# Altium schematic sheet 0002_page 2.SchDoc
size 426 x 274 mm
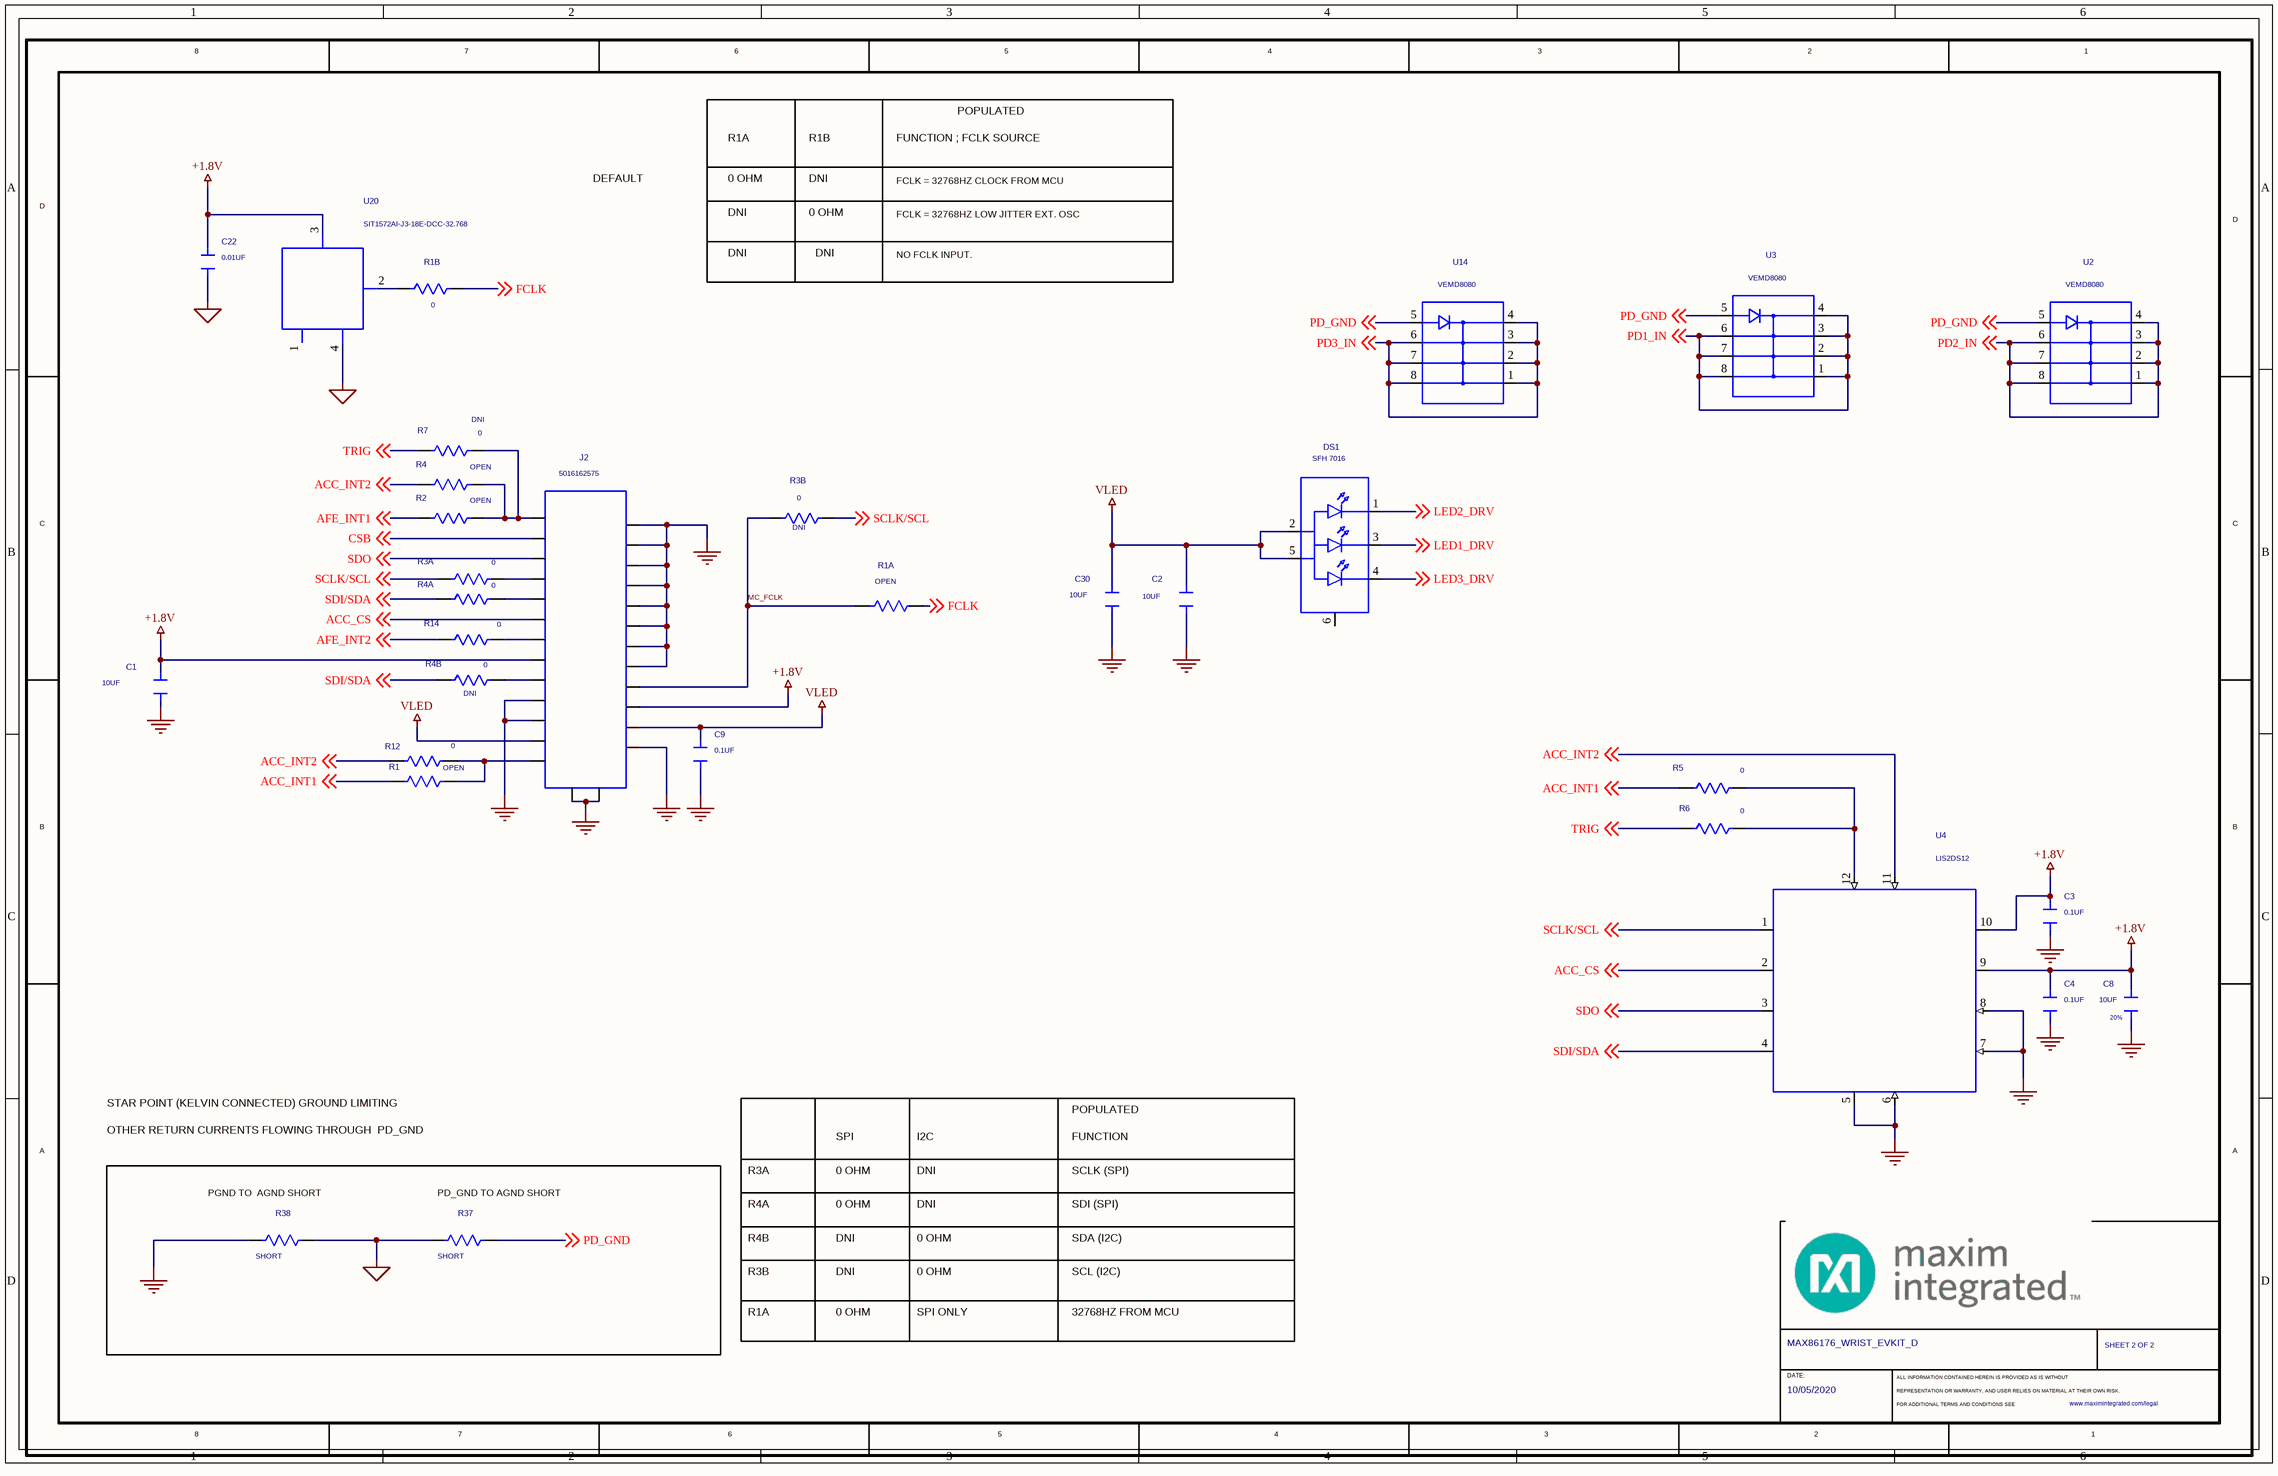
[diagram p0: 0002_page 2.SchDoc]

## Parts
*  PROJECT_TITLE: MAX86176_WRIST_EVKIT_D  CUSTOM_TXT_CDS21: SHEET 2 OF 2  DATE: 10/05/2020  (hidden comment: MAXIM_B_SIZE_CF)  (graphical)
C1  10UF  [0603]
C2  10UF  [0603]
C3  0.1UF  [0603]
C4  0.1UF  [0603]
C8  10UF  TOLERANCE: 20%  [0402]
C9  0.1UF  [CAPC0603X33M]
C22  0.01UF  [CAPC0603X33M]
C30  10UF  [0603]
DS1  SFH 7016  [LED_SFH7016]
J2  5016162575  [MOLEX_501616-2575]
R1  OPEN  [0402]
R1A  OPEN  [RESC0603X33M]
R1B  0  [RESC0603X33M]
R2  OPEN  [0402]
R3A  0  [0402]
R3B  0  VARIANT: DNI  [0402]
R4  OPEN  [0402]
R4A  0  [0402]
R4B  0  VARIANT: DNI  [0402]
R5  0  [RESC0603X33M]
R6  0  [RESC0603X33M]
R7  0  VARIANT: DNI  [RESC0603X33M]
R12  0  [RESC0603X33M]
R14  0  [RESC0603X33M]
R37  SHORT  [RESC0603X23L_SHORT]
R38  SHORT  [RESC0603X23L_SHORT]
U2  VEMD8080  [DIO_VEMD8080]
U3  VEMD8080  [DIO_VEMD8080]
U4  LIS2DS12  [STMC_LGA-12]
U14  VEMD8080  [DIO_VEMD8080]
U20  SIT1572AI-J3-18E-DCC-32.768  [OSC_SIT1572XX-JX-XXX]

## Nets
+1.8V: C1.2 C3.2 C4.2 C8.2 C22.2 J2.15 J2.20 U4.9(VDD) U4.10(VDDIO) U20.3(VDD)
AGND: C22.1 R37.1 R38.2 U20.4(GND)
PGND: C1.1 C2.1 C3.1 C4.1 C8.1 C9.1 C30.1 J2.2 J2.4 J2.6 J2.8 J2.10 J2.12 J2.14 J2.16 J2.19 J2.21 J2.24 J2.26 J2.27 R38.1 U4.5(NC) U4.6(GND_1) U4.7(RES) U4.8(GND_2)
VLED: C2.2 C9.2 C30.2 DS1.2(A_1) DS1.5(A_2) J2.22 J2.23
ACC_CS: J2.11 U4.2(CS) ; off-sheet ACC_CS
ACC_INT1: R1.1 R5.1 ; off-sheet ACC_INT1
ACC_INT2: R4.1 R12.1 U4.11(INT2) ; off-sheet ACC_INT2
AFE_INT1: R2.1 ; off-sheet AFE_INT1
AFE_INT2: R14.1 ; off-sheet AFE_INT2
CSB: J2.3 ; off-sheet CSB
FCLK: R1A.2 R1B.2 ; off-sheet FCLK
LED1_DRV: DS1.3(K_2) ; off-sheet LED1_DRV
LED2_DRV: DS1.1(K_1) ; off-sheet LED2_DRV
LED3_DRV: DS1.4(K_3) ; off-sheet LED3_DRV
MC_FCLK: J2.18 R1A.1 R3B.1
PD1_IN: U3.1(K_1) U3.2(K_2) U3.3(K_3) U3.4(K_4) U3.6(K_5) U3.7(K_6) U3.8(K_7) ; off-sheet PD1_IN
PD2_IN: U2.1(K_1) U2.2(K_2) U2.3(K_3) U2.4(K_4) U2.6(K_5) U2.7(K_6) U2.8(K_7) ; off-sheet PD2_IN
PD3_IN: U14.1(K_1) U14.2(K_2) U14.3(K_3) U14.4(K_4) U14.6(K_5) U14.7(K_6) U14.8(K_7) ; off-sheet PD3_IN
PD_GND: R37.2 U2.5(A) U3.5(A) U14.5(A) ; off-sheet PD_GND
SCLK/SCL: R3A.1 R3B.2 U4.1(SCL/SPC) ; off-sheet SCLK/SCL
SDI/SDA: R4A.1 R4B.1 U4.4(SDA/SDI/SDO) ; off-sheet SDI/SDA
SDO: J2.5 U4.3(SDO/SA0) ; off-sheet SDO
TRIG: R6.1 R7.1 ; off-sheet TRIG
NetJ2_1: J2.1 R2.2 R4.2 R7.2
NetJ2_7: J2.7 R3A.2
NetJ2_9: J2.9 R4A.2
NetJ2_13: J2.13 R14.2
NetJ2_17: J2.17 R4B.2
NetJ2_25: J2.25 R1.2 R12.2
NetR1B_1: R1B.1 U20.2(CLK_OUT)
NetR5_2: R5.2 R6.2 U4.12(INT1)

Not connected (* = marked no-connect by the designer): DS1 6(NC); U20 1(NC)

## Notes on the sheet
- R1A
- R1B
- FUNCTION ; FCLK SOURCE
- POPULATED
- DEFAULT
- 0 OHM
- DNI
- FCLK = 32768HZ CLOCK FROM MCU
- NO FCLK INPUT.
- FCLK = 32768HZ LOW JITTER EXT. OSC
- STAR POINT (KELVIN CONNECTED) GROUND LIMITING
- OTHER RETURN CURRENTS FLOWING THROUGH  PD_GND
- SPI
- I2C
- FUNCTION
- (near R38) PGND TO  AGND SHORT
- (near R37) PD_GND TO AGND SHORT
- R4A
- R3A
- SCLK (SPI)
- SDI (SPI)
- R3B
- R4B
- SCL (I2C)
- SDA (I2C)
- SPI ONLY
- 32768HZ FROM MCU
- (in symbol MAXIM_B_SIZE_CF) 8; 7; 6; 5; 4; 3; 1; D; C; B; A; DATE:; ALL INFORMATION CONTAINED HEREIN IS PROVIDED AS IS WITHOUT; REPRESENTATION OR WARRANTY, AND USER RELIES ON MATERIAL AT THEIR OWN RISK.; FOR ADDITIONAL TERMS AND CONDITIONS SEE

## Library data of the parts
* = MAXIM_B_SIZE_CF: OriginalSymbolOrigin: (175,5230); COMMENT_BODY: TRUE; Page Number: 2; CURRENT_DESIGN_SHEET: page 2; LEAGAL_WEBLINK: www.maximintegrated.com/legal; WEBLINK1: www.maximintegrated.com
C1 C2 C30 = EK_CAP_NP: CAP; SMT (0603); 10UF; 20%; 25V; X5R; CERAMIC CHIP; MFG_PART_NUMBER: GRM188R61E106MA73; MANUFACTURER: MURATA; OriginalSymbolOrigin: (-50,50); MAXINV: 20-0010U-P7; CAP: 1.00E-05; DRAWING: @MAX86176_WRIST_EVKIT_D.MAX86176_WRIST_EVKIT_D(SCH_1):PAGE4; PHYS_PAGE: 2; TEMP_RANGE: -55 DEGC TO +85 DEGC; VLOG_PARAM01: CAP:INTEGER; PACK_TYPE: 0603; PCB Footprint_CDS: 0603; CASE: SMT (0603); REFLOW: -; TOLERANCE: 20%; VER: 2; VOLTAGE_RATING: 25V; MATERIAL_TYPE: CERAMIC CHIP
C3 C4 = CAP_NP: CAP; SMT (0603); 0.1UF; 10%; 100V; X7R; CERAMIC; MFG_PART_NUMBER: GRM188R72A104KA35; CC0603KRX7R0BB104; MANUFACTURER: YAGEO;MURATA;TAIYO YUDEN;AVX;MURATA; OriginalSymbolOrigin: (-50,50); PACK_TYPE: 0603CAP; MAXINV: 20-000U1-01; CAP: 1.00E-07; DRAWING: @MAX86176_WRIST_EVKIT_D.MAX86176_WRIST_EVKIT_D(SCH_1):PAGE4; PHYS_PAGE: 2; TEMP_RANGE: -55 DEGC TO +125 DEGC; VLOG_PARAM01: CAP:INTEGER; PCB Footprint_CDS: 0603; REFLOW: -; TOLERANCE: 10%; VER: 2; VOLTAGE_RATING: 100V
C8 = CAP_NP#1: CAP; SMT (0402); 10UF; 20%; 10V; X5R; CERAMIC; MFG_PART_NUMBER: GRM155R61A106ME44;GRM155R61A106ME11;0402ZD106MAT2A;CL05A106MP5NUNC; MANUFACTURER: MURATA;MURATA;AVX;SAMSUNG; OriginalSymbolOrigin: (-50,50); PACK_TYPE: 0402CAP; MAXINV: 20-0010U-BA12; CAP: 1.00E-05; DRAWING: @MAX86176_WRIST_EVKIT_D.MAX86176_WRIST_EVKIT_D(SCH_1):PAGE4; PHYS_PAGE: 2; VER: 1; TEMP_RANGE: -55 DEGC TO +85 DEGC; VLOG_PARAM01: CAP:INTEGER; PCB Footprint_CDS: 0402; CASE: SMT (0402); REFLOW: -; VOLTAGE_RATING: 10V
C9 = CAP_NP: CAP; SMT (0201); 0.1UF; 10%; 10V; X5R; CERAMIC; MFG_PART_NUMBER: GRM033R61A104KE15; LMK063BJ104KP; MANUFACTURER: MURATA;TAIYO YUDEN; OriginalSymbolOrigin: (-50,50); PACK_TYPE: 0201CAPM; MAXINV: 20-000U1-H9; CAP: 1.00E-07; DRAWING: @MAX86176_WRIST_EVKIT_D.MAX86176_WRIST_EVKIT_D(SCH_1):PAGE4; PHYS_PAGE: 2; TEMP_RANGE: -55 DEGC TO +85 DEGC; VLOG_PARAM01: CAP:INTEGER; PCB Footprint_CDS: CAPC0603X33M; CASE: SMT (0201); REFLOW: -; TOLERANCE: N/A; VER: 2; VOLTAGE_RATING: 10V; MATERIAL_TYPE: CERAMIC
C22 = CAP_NP: CAP; SMT (0201); 0.01UF; 10%; 10V; X7R; CERAMIC; MFG_PART_NUMBER: C0603X7R1A103K030BA;GRM033R71A103KA01;GCM033R71A103KA03;CGA1A2X7R1A103K030BA;0201ZC103KAT2A; MANUFACTURER: TDK;MURATA;MURATA;TDK;AVX; OriginalSymbolOrigin: (-50,50); PACK_TYPE: 0201CAPM; MAXINV: 20-00U01-I6; CAP: 1.00E-08; DRAWING: @MAX86176_WRIST_EVKIT_D.MAX86176_WRIST_EVKIT_D(SCH_1):PAGE4; PHYS_PAGE: 2; TEMP_RANGE: -55 DEGC TO +125 DEGC; VLOG_PARAM01: CAP:INTEGER; MATERIAL_TYPE: CERAMIC CHIP; PCB Footprint_CDS: CAPC0603X33M; CASE: SMT (0201); REFLOW: -; TOLERANCE: 10%; VER: 2; VOLTAGE_RATING: 10V
DS1 = LED_6P: DIODE; LED; RED-GREEN-IR; SMT; VF=RED=2.1V; GREEN=2.5V; IR=1.3V; IF=RED=0.04A; GREEN=0.03A; IR=0.06A ;NOTE:PURCHASE DIRECT FROM THE MANUFACTURER; MANUFACTURER: OSRAM; OriginalSymbolOrigin: (-125,250); MAXINV: ED111000003532; DRAWING: @MAX86176_WRIST_EVKIT_D.MAX86176_WRIST_EVKIT_D(SCH_1):PAGE4; PHYS_PAGE: 2; VER: 7; TEMP_RANGE: -40 DEGC TO +85 DEGC; PACK_TYPE: LED_SFH7016; PCB Footprint_CDS: LED_SFH7016; MFG_PART_NUMBER: SFH 7016; SEC_TYPE: LED_SFH7016; TOLERANCE: N/A; VOLTAGE_RATING: RED=2.1V; GREEN=2.5V; IR=1.3V
J2 = 501616-2575: CONNECTOR; FEMALE; SMT; EASY-ON TYPE FPC CONNECTOR; RIGHT ANGLE; 25PINS ;NOTE:DISCONTINUED BY MANUFACTURER; MANUFACTURER: MOLEX; OriginalSymbolOrigin: (-150,550); PACK_TYPE: RA; MAXINV: 01-501616257525P-29; DRAWING: @MAX86176_WRIST_EVKIT_D.MAX86176_WRIST_EVKIT_D(SCH_1):PAGE4; PHYS_PAGE: 2; VER: 1; VOLTAGE_RATING: +50V; TEMP_RANGE: -40 DEGC TO +85 DEGC; PCB Footprint_CDS: MOLEX_501616-2575; MFG_PART_NUMBER: 5016162575; REFLOW: -; SEC_TYPE: RA; TOLERANCE: N/A
R1 R2 R4 = EVK_GENERIC_RESISTORS: PACKAGE OUTLINE 0402 RESISTOR - EVKIT; OriginalSymbolOrigin: (-75,50); DRAWING: @MAX86176_WRIST_EVKIT_D.MAX86176_WRIST_EVKIT_D(SCH_1):PAGE4; PHYS_PAGE: 2; PACK_TYPE: 0402RES; MAXINV: N/A; PCB Footprint_CDS: 0402; CASE: SMT (0402); MFG_PART_NUMBER: N/A; POWER_RATING: N/A; TOLERANCE: N/A; VER: 2; VOLTAGE_RATING: N/A; MANUFACTURER: N/A; TEMP_RANGE: N/A; MATERIAL_TYPE: N/A
R1A = EVK_GENERIC_RESISTORS#1: PACKAGE OUTLINE 0201 RESISTOR - EVKIT; OriginalSymbolOrigin: (-50,75); DRAWING: @MAX86176_WRIST_EVKIT_D.MAX86176_WRIST_EVKIT_D(SCH_1):PAGE4; PHYS_PAGE: 2; VER: 4; PACK_TYPE: 0201RES; MAXINV: N/A; PCB Footprint_CDS: RESC0603X33M; CASE: SMT (0201); MFG_PART_NUMBER: N/A; POWER_RATING: N/A; TOLERANCE: N/A; VOLTAGE_RATING: N/A; MANUFACTURER: N/A; TEMP_RANGE: N/A
R1B R14 = RES_SMD#1: RES; SMT (0201); 0; 1%; JUMPER; 0.0500W; MFG_PART_NUMBER: CRCW02010000ZS;ERJ-1GN0R00; MANUFACTURER: VISHAY DALE;PANASONIC; OriginalSymbolOrigin: (-75,50); PACK_TYPE: 0201RES; MAXINV: 80-0000R-95; DRAWING: @MAX86176_WRIST_EVKIT_D.MAX86176_WRIST_EVKIT_D(SCH_1):PAGE4; PHYS_PAGE: 2; POWER_RATING: 0.05W; RES: 0.00000001E00; TEMP_RANGE: -55 DEGC TO +155 DEGC; VLOG_PARAM01: RES:INTEGER; PCB Footprint_CDS: RESC0603X33M; CASE: SMT (0201); REFLOW: -; TOLERANCE: 1%; VER: 2
R3A R4A = RES_SMD#1: RES; SMT (0402); 0; JUMPER; JUMPER; 0.1000W; MFG_PART_NUMBER: ERJ-2GE0R00; MANUFACTURER: PANASONIC; OriginalSymbolOrigin: (-75,50); PACK_TYPE: 0402RES; MAXINV: 80-0000R-26A; DRAWING: @MAX86176_WRIST_EVKIT_D.MAX86176_WRIST_EVKIT_D(SCH_1):PAGE4; PHYS_PAGE: 2; POWER_RATING: 0.10W; RES: 0.00000001E00; TOLERANCE: 0%; TEMP_RANGE: -55 DEGC TO +155 DEGC; VLOG_PARAM01: RES:INTEGER; MATERIAL_TYPE: THICK FILM; PCB Footprint_CDS: 0402; CASE: SMT (0402); REFLOW: -; VER: 2
R3B R4B = RES_SMD#1: RES; SMT (0402); 0; JUMPER; JUMPER; 0.1000W; MFG_PART_NUMBER: ERJ-2GE0R00; MANUFACTURER: PANASONIC; OriginalSymbolOrigin: (-75,50); PACK_TYPE: 0402RES; MAXINV: 80-0000R-26A; DRAWING: @MAX86176_WRIST_EVKIT_D.MAX86176_WRIST_EVKIT_D(SCH_1):PAGE4; PHYS_PAGE: 2; POWER_RATING: 0.10W; RES: 0.00000001E00; TOLERANCE: 0%; TEMP_RANGE: -55 DEGC TO +155 DEGC; MATERIAL_TYPE: THICK FILM; VLOG_PARAM01: RES:INTEGER; PCB Footprint_CDS: 0402; CASE: SMT (0402); REFLOW: -; VER: 2
R5 R12 = RES_SMD#1: RES; SMT (0201); 0; 1%; JUMPER; 0.0500W; MFG_PART_NUMBER: CRCW02010000ZS;ERJ-1GN0R00; MANUFACTURER: VISHAY DALE;PANASONIC; OriginalSymbolOrigin: (-75,50); PACK_TYPE: 0201RES; MAXINV: 80-0000R-95; DRAWING: @MAX86176_WRIST_EVKIT_D.MAX86176_WRIST_EVKIT_D(SCH_1):PAGE4; PHYS_PAGE: 2; POWER_RATING: 0.05W; RES: 0.00000001E00; TEMP_RANGE: -55 DEGC TO +155 DEGC; MATERIAL_TYPE: THICK FILM; VLOG_PARAM01: RES:INTEGER; PCB Footprint_CDS: RESC0603X33M; CASE: SMT (0201); REFLOW: -; TOLERANCE: 1%; VER: 2
R6 R7 = RES_SMD#1: RES; SMT (0201); 0; 1%; JUMPER; 0.0500W; MFG_PART_NUMBER: CRCW02010000ZS;ERJ-1GN0R00; MANUFACTURER: VISHAY DALE;PANASONIC; OriginalSymbolOrigin: (-75,50); PACK_TYPE: 0201RES; MAXINV: 80-0000R-95; DRAWING: @MAX86176_WRIST_EVKIT_D.MAX86176_WRIST_EVKIT_D(SCH_1):PAGE4; PHYS_PAGE: 2; POWER_RATING: 0.05W; RES: 0.00000001E00; TEMP_RANGE: -55 DEGC TO +155 DEGC; VLOG_PARAM01: RES:INTEGER; MATERIAL_TYPE: THICK FILM; PCB Footprint_CDS: RESC0603X33M; CASE: SMT (0201); REFLOW: -; TOLERANCE: 1%; VER: 2
R37 R38 = EVK_GENERIC_RESISTORS: PACKAGE OUTLINE 0201 RESISTOR - EVKIT FORM FACTOR FOOTRINT; OriginalSymbolOrigin: (-75,50); PACK_TYPE: 0201RES_FF; DRAWING: @MAX86176_WRIST_EVKIT_D.MAX86176_WRIST_EVKIT_D(SCH_1):PAGE4; PHYS_PAGE: 2; MAXINV: N/A; PCB Footprint_CDS: RESC0603X23L_SHORT; CASE: SMT (0201); MFG_PART_NUMBER: N/A; POWER_RATING: N/A; TOLERANCE: N/A; VER: 2; VOLTAGE_RATING: N/A; MANUFACTURER: N/A; TEMP_RANGE: N/A; MATERIAL_TYPE: N/A
U2 U3 U14 = DIO_PIN_8P: DIODE; PIN; SMT; VRM=20V; IF=0.05A ;NOTE:PURCHASE DIRECT FROM THE MANUFACTURER; MANUFACTURER: VISHAY; OriginalSymbolOrigin: (-150,200); PACK_TYPE: SMD; MAXINV: ED1259; DRAWING: @MAX86176_WRIST_EVKIT_D.MAX86176_WRIST_EVKIT_D(SCH_1):PAGE4; PHYS_PAGE: 2; VER: 1; VOLTAGE_RATING: 20V; TEMP_RANGE: -40 DEGC TO +85 DEGC; PCB Footprint_CDS: DIO_VEMD8080; MFG_PART_NUMBER: VEMD8080; SEC_TYPE: SMD; TOLERANCE: N/A
U4 = LIS2DS12: IC; MEMS; DIGITAL OUTPUT MOTION SENSOR; ULTRA-LOW-POWER HIGH-PERFORMANCE 3-AXIS PICO ACCELEROMETER; MICROELECTROMECHANICAL SYSTEMS; LGA12; NOTE: MANUFACTURER; MANUFACTURER: ST MICROELECTRONICS; OriginalSymbolOrigin: (-375,375); MAXINV: EQ111000005315; DRAWING: @MAX86176_WRIST_EVKIT_D.MAX86176_WRIST_EVKIT_D(SCH_1):PAGE4; PHYS_PAGE: 2; VER: 1; VOLTAGE_RATING: +1.62V TO +1.98V; TEMP_RANGE: -40 DEGC TO +85 DEGC; PACK_TYPE: LGA12; PCB Footprint_CDS: STMC_LGA-12; CASE: LGA12; MFG_PART_NUMBER: LIS2DS12; TOLERANCE: N/A
U20 = SIT1572: OSCILLATOR; CSP 1.5 MM X 0.8 MM; 15PF; 32.768KHZ ; +/-10PPM; MANUFACTURER: SITIME CORPORATION; OriginalSymbolOrigin: (-175,200); PACK_TYPE: SMD; MAXINV: EX111000005339; DRAWING: @MAX86176_WRIST_EVKIT_D.MAX86176_WRIST_EVKIT_D(SCH_1):PAGE4; PHYS_PAGE: 2; VER: 1; VOLTAGE_RATING: +1.8V; TEMP_RANGE: -40 DEGC TO +85 DEGC; PCB Footprint_CDS: OSC_SIT1572XX-JX-XXX; MFG_PART_NUMBER: SIT1572AI-J3-18E-DCC-32.768; TOLERANCE: N/A